# Altium project Sensor_PCI_V1.PrjPcb
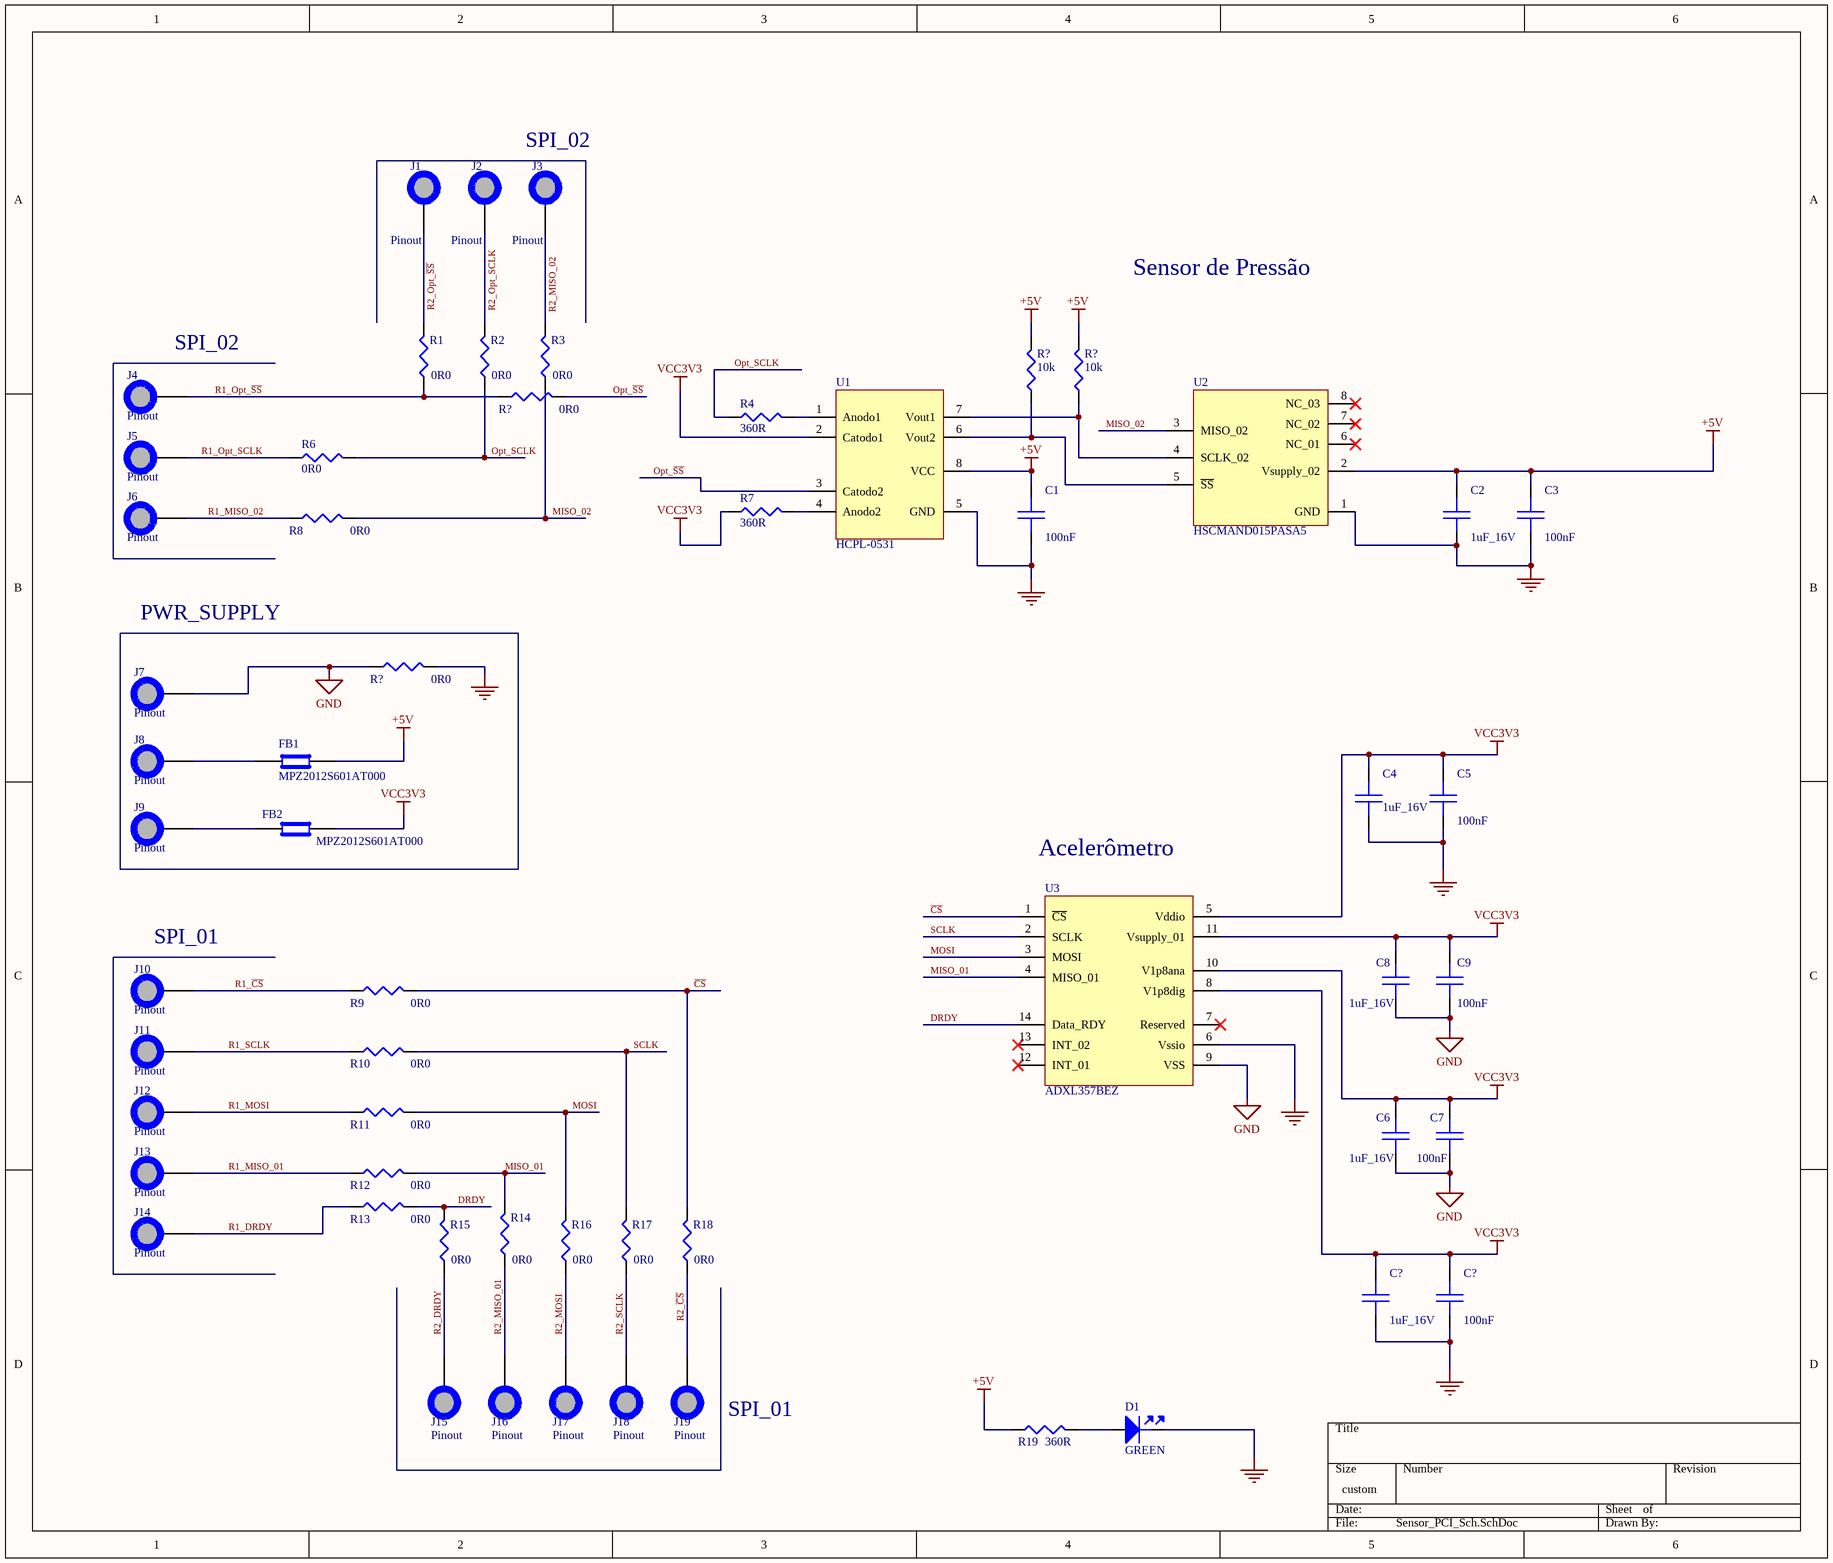
[diagram p0: Sensor_PCI_Sch.SchDoc]
1 sheet, 58 parts. Net scope: global (net labels, ports and power ports of the same name join across sheets).
Board file: Sensor_PCI_pcb.PcbDoc

## Sheet Sensor_PCI_Sch.SchDoc
size 342 x 292 mm; SheetNumber: 1; SheetTotal: 1

### Parts
(Parts that share a designator on the sheet are numbered #1, #2 ... from top to bottom, then left to right.)
C1  100nF  [CP_0805]
C2  1uF_16V  [C_1206]
C3  100nF  [CP_0805]
C4  1uF_16V  [C_1206]
C5  100nF  [CP_0805]
C6  1uF_16V  [C_1206]
C7  100nF  [CP_0805]
C8  1uF_16V  [C_1206]
C9  100nF  [CP_0805]
C?#1  1uF_16V  [C_1206]
C?#2  100nF  [CP_0805]
D1  GREEN  [LED_Green]
FB1  MPZ2012S601AT000  [CP_0805]
FB2  MPZ2012S601AT000  [CP_0805]
J1  Pinout  [Pinout]
J2  Pinout  [Pinout]
J3  Pinout  [Pinout]
J4  Pinout  [Pinout]
J5  Pinout  [Pinout]
J6  Pinout  [Pinout]
J7  Pinout  [Pinout]
J8  Pinout  [Pinout]
J9  Pinout  [Pinout]
J10  Pinout  [Pinout]
J11  Pinout  [Pinout]
J12  Pinout  [Pinout]
J13  Pinout  [Pinout]
J14  Pinout  [Pinout]
J15  Pinout  [Pinout]
J16  Pinout  [Pinout]
J17  Pinout  [Pinout]
J18  Pinout  [Pinout]
J19  Pinout  [Pinout]
R1  0R0  [R_0805]
R2  0R0  [R_0805]
R3  0R0  [R_0805]
R4  360R  [R_0805]
R6  0R0  [R_0805]
R7  360R  [R_0805]
R8  0R0  [R_0805]
R9  0R0  [R_0805]
R10  0R0  [R_0805]
R11  0R0  [R_0805]
R12  0R0  [R_0805]
R13  0R0  [R_0805]
R14  0R0  [R_0805]
R15  0R0  [R_0805]
R16  0R0  [R_0805]
R17  0R0  [R_0805]
R18  0R0  [R_0805]
R19  360R  [R_0805]
R?#1  10k  [R_0805]
R?#2  10k  [R_0805]
R?#3  0R0  [R_0805]
R?#4  0R0  [R_0805]
U1  HCPL-0531  [SMT_08_1.3mm]
U2  HSCMAND015PASA5  [SMT_08_2.54mm]
U3  ADXL357BEZ  [Quad_14_1.2mm]

### Blocks framed on the sheet
PWR_SUPPLY: FB1 FB2 J7-J9 R?#4

### Nets
+5V: C1.2 C2.1 C3.2 FB1.2 R19.1 R?#1.2 R?#2.2 U1.8(VCC) U2.2(Vsupply_02)
GND: C1.1 C2.2 C3.1 C4.2 C5.1 C6.2 C7.1 C8.2 C9.1 C?#1.2 C?#2.1 D1.1(KAT) J7.1 R?#4.1 R?#4.2 U1.5(GND) U2.1(GND) U3.6(Vssio) U3.9(VSS)
VCC3V3: C4.1 C5.2 C6.1 C7.2 C8.1 C9.2 C?#1.1 C?#2.2 FB2.2 R7.1 U1.2(Catodo1) U3.5(Vddio) U3.8(V1p8dig) U3.10(V1p8ana) U3.11(Vsupply_01)
~{CS}: R9.2 R18.2 U3.1(~{CS})
DRDY: R13.2 R15.2 U3.14(Data_RDY)
MISO_01: R12.2 R14.2 U3.4(MISO_01)
MISO_02: R3.1 R8.2 U2.3(MISO_02)
MOSI: R11.2 R16.2 U3.3(MOSI)
Opt_~{SS}: R?#3.2 U1.3(Catodo2)
Opt_SCLK: R2.1 R4.1 R6.2
R1_~{CS}: J10.1 R9.1
R1_DRDY: J14.1 R13.1
R1_MISO_01: J13.1 R12.1
R1_MISO_02: J6.1 R8.1
R1_MOSI: J12.1 R11.1
R1_Opt_~{SS}: J4.1 R1.1 R?#3.1
R1_Opt_SCLK: J5.1 R6.1
R1_SCLK: J11.1 R10.1
R2_~{CS}: J19.1 R18.1
R2_DRDY: J15.1 R15.1
R2_MISO_01: J16.1 R14.1
R2_MISO_02: J3.1 R3.2
R2_MOSI: J17.1 R16.1
R2_Opt_~{SS}: J1.1 R1.2
R2_Opt_SCLK: J2.1 R2.2
R2_SCLK: J18.1 R17.1
SCLK: R10.2 R17.2 U3.2(SCLK)
NetD1_2: D1.2(ANODE) R19.2
NetFB1_1: FB1.1 J8.1
NetFB2_1: FB2.1 J9.1
NetR4_2: R4.2 U1.1(Anodo1)
NetR7_2: R7.2 U1.4(Anodo2)
NetR?#1_1: R?#1.1 U1.6(Vout2) U2.5(~{SS})
NetR?#2_1: R?#2.1 U1.7(Vout1) U2.4(SCLK_02)

Not connected (* = marked no-connect by the designer): U2 6(NC_01)* 7(NC_02)* 8(NC_03)*; U3 7(Reserved)* 12(INT_01)* 13(INT_02)*

### Notes on the sheet
- SPI_02
- Sensor de Pressão
- (near J4) SPI_02
- Acelerômetro
- (near J10) SPI_01
- (near J19) SPI_01

### Library data of the parts
C1 C3 C5 C7 C9 C?#2 = C_0805_0.1uF: Cap Ceramic 0.1uF 50V X7R 20% Pad SMD 0805 150°C T/R; Manufacturer: Vishay Vitramon; Manufacturer Part Number: VJ0805Y104MXAMR; Supplier 1: Mouser; RoHS: Yes; Category: Ceramic Capacitors; Stock 1: 26836; Pricing 1: 1=0,33000, 10=0,23700, 50=0,23700, 100=0,14200, 1000=0,09000, 10000=0,07300 (USD); Mount: Surface Mount; Case/Package: 0805; Case Code (Imperial): 0805; Case Code (Metric): 2012; Min Operating Temperature: -55°C; Max Operating Temperature: 150°C; Capacitance: 100nF; Voltage Rating (DC): 50V; Tolerance: 20%; Packaging: Tape and Reel; Package Quantity: 10000; Dielectric: X7R; Termination: SMD/SMT; Series: VJ COMM; Construction: Flat; Length: 2mm; Width: 1.25mm; Height: 1.45mm; Depth: 1.25mm; RoHS Compliant: Yes; ComponentLink1URL: http://www.mouser.com/ds/2/427/vjcommercialseries-222796.pdf?src-supplier=Mouser; ComponentLink1Description: http://www.mouser.com/ds/2/427/vjcommercialseries-222796.pdf?src-supplier=Mouser; ComponentLink2URL: http://www.vishay.com/docs/45199/commseri.pdf?src-supplier=Avnet; ComponentLink2Description: http://www.vishay.com/docs/45199/commseri.pdf?src-supplier=Avnet; ComponentLink3URL: http://www.vishay.com/docs/45199/vjcommercialseries.pdf?src-supplier=Digi-Key; ComponentLink3Description: http://www.vishay.com/docs/45199/vjcommercialseries.pdf?src-supplier=Digi-Key; ComponentLink4URL: http://www.vishay.com/docs/45051/vjvitramonpackaging.pdf?src-supplier=Digi-Key; ComponentLink4Description: http://www.vishay.com/docs/45051/vjvitramonpackaging.pdf?src-supplier=Digi-Key; Supplier Part Number 1: 77-VJ0805Y104MXAMR
C2 C4 C6 C8 C?#1 = C_1206_1uF_16V: Cap Ceramic 1uF 16V Y5V 20% SMD 1206 85°C Plastic T/R; Manufacturer: Vishay Vitramon; Manufacturer Part Number: VJ1206V105MXJTW1BC; Dielectric Material: Tantalum; Supplier 1: Mouser; RoHS: Yes; Category: Ceramic Capacitors; Stock 1: 370; Pricing 1: 1=0,44000, 10=0,31000, 50=0,31000, 100=0,18600, 1000=0,11800, 10000=0,09500 (USD); Mount: Surface Mount; Case/Package: 1206; Case Code (Metric): 3216; Case Code (Imperial): 1206; Weight: 0.000571oz; Min Operating Temperature: -25°C; Max Operating Temperature: 85°C; Capacitance: 1uF; Tolerance: 20%; Packaging: Tape and Reel; Package Quantity: 3000; Voltage Rating (DC): 16V; Dielectric: Y5V; Termination: SMD/SMT; Series: VJ W1BC; Construction: Flat; Length: 3.2mm; Width: 1.6mm; Height: 1.9mm; Depth: 1.6mm; Lead Free: Lead Free; ComponentLink1URL: https://datasheet.ciiva.com/5418/vjw1bcbascomseries-223529-5418534.pdf?src-supplier=Mouser; ComponentLink1Description: https://datasheet.ciiva.com/5418/vjw1bcbascomseries-223529-5418534.pdf?src-supplier=Mouser; Supplier Part Number 1: 77-VJ1206V105MXJTBC
D1 = Led Green_1: LED Single Chip Green 570nm 20mA 2-Pin 0603 T/R; Manufacturer: Osram Opto; Manufacturer Part Number: LGL29K-G2J1-24-Z; Lens Color: White; Forward Voltage: 2.2V; Luminous Intensity: 5.6mcd; Viewing Angle: 160°; Lens Style: Flat,Diffused,Colorless,Rectangular; Test Current: 2mA; Luminous Flux: 0.012lm; Number of LEDs: 1; Lens Transparency: Diffused; Reverse Voltage: 12V; Lens Size: 0.8mm; Supplier 1: Arrow Electronics; RoHS: Yes; Category: LEDs; Mount: Surface Mount; Case/Package: 0603; Number of Pins: 2; Color: Green; Case Code (Metric): 1608; Case Code (Imperial): 0603; Min Operating Temperature: -40°C; Max Operating Temperature: 100°C; Illumination Color: Green; Forward Current: 20mA; Packaging: Tape and Reel; Package Quantity: 5000; Dominant Wavelength: 570nm; Number of Elements: 1; Series: SmartLED; Length: 1.3mm; Width: 0.8mm; Height: 0.65mm; Depth: 0.8mm; Radiation Hardening: No; RoHS Compliant: Yes; ComponentLink1URL: https://datasheet.ciiva.com/4689/g-l29k-39844-4689584.pdf?src-supplier=Mouser; ComponentLink1Description: https://datasheet.ciiva.com/4689/g-l29k-39844-4689584.pdf?src-supplier=Mouser; ComponentLink2URL: https://datasheet.ciiva.com/15198/getdatasheetpartid-571127-15198411.pdf?src-supplier=Verical; ComponentLink2Description: https://datasheet.ciiva.com/15198/getdatasheetpartid-571127-15198411.pdf?src-supplier=Verical; ComponentLink3URL: https://datasheet.ciiva.com/2112/00077107-0-2112887.pdf?src-supplier=Digi-Key; ComponentLink3Description: https://datasheet.ciiva.com/2112/00077107-0-2112887.pdf?src-supplier=Digi-Key; ComponentLink4URL: https://datasheet.ciiva.com/2112/00077107-0-2112886.pdf?src-supplier=Digi-Key; ComponentLink4Description: https://datasheet.ciiva.com/2112/00077107-0-2112886.pdf?src-supplier=Digi-Key; ComponentLink5URL: https://datasheet.ciiva.com/2112/00077107-0-2112888.pdf?src-supplier=Digi-Key; ComponentLink5Description: https://datasheet.ciiva.com/2112/00077107-0-2112888.pdf?src-supplier=Digi-Key; Supplier Part Number 1: LG L29K-G2J1-24-Z
FB1 FB2 = MPZ2012S601AT000: 0805 600Ω ±25% DCR=0.1Ω 2A; Manufacturer: TDK; Impedance: 600R; DC Resistance (DCR): 100mR; Number of Lines: 1; Supplier 1: Mouser; Manufacturer Part Number: MPZ2012S601AT000; RoHS: Yes; Category: Ferrite Beads and Chips; Stock 1: 15; Pricing 1: 1=0,13000, 10=0,08200, 50=0,08200, 100=0,05000, 1000=0,03700, 10000=0,03600 (USD); Mount: Surface Mount; Case/Package: 0805; Case Code (Metric): 2012; Case Code (Imperial): 0805; Min Operating Temperature: -55°C; Max Operating Temperature: 125°C; Packaging: Tape and Reel; Package Quantity: 1; Current Rating: 2A; Max DC Current: 2A; Series: MPZ; Max Current Rating: 2A; Length: 0.079inch; Width: 0.049inch; Height: 0.041inch; Reach SVHC Compliant: Yes; Lead Free: Lead Free; RoHS Compliant: Yes; ComponentLink1URL: https://datasheet.ciiva.com/46634/beads-commercial-power-mpz-en-46634335.pdf?src-supplier=Digi-Key; ComponentLink1Description: https://datasheet.ciiva.com/46634/beads-commercial-power-mpz-en-46634335.pdf?src-supplier=Digi-Key; ComponentLink2URL: https://datasheet.ciiva.com/46634/beads-commercial-power-mpz-en-46634377.pdf?src-supplier=Digi-Key; ComponentLink2Description: https://datasheet.ciiva.com/46634/beads-commercial-power-mpz-en-46634377.pdf?src-supplier=Digi-Key; ComponentLink3URL: https://datasheet.ciiva.com/46634/beads-commercial-power-mpz-en-46634606.pdf?src-supplier=Digi-Key; ComponentLink3Description: https://datasheet.ciiva.com/46634/beads-commercial-power-mpz-en-46634606.pdf?src-supplier=Digi-Key; Supplier Part Number 1: 810-MPZ2012S601AT000
R1-R3 R6 R8-R18 R?#3 R?#4 = Res_0805_0R0: CRCW Thick Film Commodity Chip Resistor Jumper 0805 Size 0 Ohm 0.125 W 2-Pin SMD Paper T/R; Manufacturer: Vishay Dale; Manufacturer Part Number: CRCW08050000Z0ECC; Resistance: 0mR; Max Power Dissipation: 125mW; Supplier 1: Mouser; RoHS: Yes; Category: Chip SMD Resistors; Stock 1: 327854; Pricing 1: 1=0,10000, 10=0,04200, 50=0,04200, 100=0,01700, 1000=0,00800, 10000=0,00500 (USD); Case/Package: 0805; Case Code (Imperial): 0805; Case Code (Metric): 2012; Min Operating Temperature: -55°C; Max Operating Temperature: 155°C; Resistor Type: Thick Film; Packaging: Tape and Reel; Number of Terminations: 2; RoHS Compliant: Yes; ComponentLink1URL: http://www.vishay.com/docs/28773/crcwce3.pdf?src-supplier=Digi-Key; ComponentLink1Description: http://www.vishay.com/docs/28773/crcwce3.pdf?src-supplier=Digi-Key; Supplier Part Number 1: 71-CRCW08050000Z0ECC
R4 R7 R19 = Res_0805_360R: Res Thick Film 0805 360 Ohm 5% 1/8W ±200ppm/°C Molded SMD SMD Paper T/R; Manufacturer: Vishay Dale; Manufacturer Part Number: CRCW0805360RJNEA; Power Rating: 125mW; Voltage Rating: 150V; Supplier 1: Mouser; RoHS: Yes; Category: Chip SMD Resistors; Stock 1: 4310; Pricing 1: 1=0,10000, 10=0,05000, 50=0,05000, 100=0,02100, 1000=0,01000, 10000=0,00600 (USD); Case/Package: 0805; Number of Pins: 2; Weight: 0.000194oz; Case Code (Imperial): 0805; Case Code (Metric): 2012; Contact Plating: Tin; Min Operating Temperature: -55°C; Max Operating Temperature: 155°C; Resistance: 360R; Tolerance: 5%; Packaging: Cut Tape; Package Quantity: 1; Termination: SMD/SMT; Resistor Type: Thick Film; Number of Terminations: 2; Temperature Coefficient: 200ppm/°C; Max Power Dissipation: 125mW; Voltage Rating (DC): 150V; Features: Automotive AEC-Q200; Series: CRCW; Length: 0.079inch; Width: 0.049inch; Height: 0.02inch; Depth: 1.25mm; Height - Seated (Max): 0.02inch; Ratings: AEC-Q200; Radiation Hardening: No; RoHS Compliant: Yes; Military Standard: Not; Lead Free: Lead Free; ComponentLink1URL: https://datasheet.ciiva.com/2464/dcrcwe3-2464844.pdf?src-supplier=Digi-Key; ComponentLink1Description: https://datasheet.ciiva.com/2464/dcrcwe3-2464844.pdf?src-supplier=Digi-Key; ComponentLink2URL: https://datasheet.ciiva.com/2464/dcrcwe3-2464845.pdf?src-supplier=Digi-Key; ComponentLink2Description: https://datasheet.ciiva.com/2464/dcrcwe3-2464845.pdf?src-supplier=Digi-Key; ComponentLink3URL: https://datasheet.ciiva.com/2464/dcrcwe3-2464843.pdf?src-supplier=Digi-Key; ComponentLink3Description: https://datasheet.ciiva.com/2464/dcrcwe3-2464843.pdf?src-supplier=Digi-Key; ComponentLink4URL: https://datasheet.ciiva.com/5552/dcrcwe3-109170-5552246.pdf?src-supplier=Mouser; ComponentLink4Description: https://datasheet.ciiva.com/5552/dcrcwe3-109170-5552246.pdf?src-supplier=Mouser; ComponentLink5URL: https://datasheet.ciiva.com/8942/dcrcwe3-8942602.pdf?src-supplier=Avnet; ComponentLink5Description: https://datasheet.ciiva.com/8942/dcrcwe3-8942602.pdf?src-supplier=Avnet; ComponentLink6URL: https://datasheet.ciiva.com/16334/dcrcwe3-16334181.pdf?src-supplier=Future+Electronics; ComponentLink6Description: https://datasheet.ciiva.com/16334/dcrcwe3-16334181.pdf?src-supplier=Future+Electronics; Supplier Part Number 1: 71-CRCW0805360RJNEA
R?#1 R?#2 = Res_0805_360R: Res Thick Film 0805 360 Ohm 5% 1/8W ±200ppm/°C Molded SMD SMD Paper T/R; Manufacturer: Vishay Dale; Manufacturer Part Number: CRCW0805360RJNEA; Resistance: 360R; Power Rating: 125mW; Voltage Rating: 150V; Supplier 1: Mouser; RoHS: Yes; Category: Chip SMD Resistors; Stock 1: 4310; Pricing 1: 1=0,10000, 10=0,05000, 50=0,05000, 100=0,02100, 1000=0,01000, 10000=0,00600 (USD); Case/Package: 0805; Number of Pins: 2; Weight: 0.000194oz; Case Code (Imperial): 0805; Case Code (Metric): 2012; Contact Plating: Tin; Min Operating Temperature: -55°C; Max Operating Temperature: 155°C; Tolerance: 5%; Packaging: Cut Tape; Package Quantity: 1; Termination: SMD/SMT; Resistor Type: Thick Film; Number of Terminations: 2; Temperature Coefficient: 200ppm/°C; Max Power Dissipation: 125mW; Voltage Rating (DC): 150V; Features: Automotive AEC-Q200; Series: CRCW; Length: 0.079inch; Width: 0.049inch; Height: 0.02inch; Depth: 1.25mm; Height - Seated (Max): 0.02inch; Ratings: AEC-Q200; Radiation Hardening: No; RoHS Compliant: Yes; Military Standard: Not; Lead Free: Lead Free; ComponentLink1URL: https://datasheet.ciiva.com/2464/dcrcwe3-2464844.pdf?src-supplier=Digi-Key; ComponentLink1Description: https://datasheet.ciiva.com/2464/dcrcwe3-2464844.pdf?src-supplier=Digi-Key; ComponentLink2URL: https://datasheet.ciiva.com/2464/dcrcwe3-2464845.pdf?src-supplier=Digi-Key; ComponentLink2Description: https://datasheet.ciiva.com/2464/dcrcwe3-2464845.pdf?src-supplier=Digi-Key; ComponentLink3URL: https://datasheet.ciiva.com/2464/dcrcwe3-2464843.pdf?src-supplier=Digi-Key; ComponentLink3Description: https://datasheet.ciiva.com/2464/dcrcwe3-2464843.pdf?src-supplier=Digi-Key; ComponentLink4URL: https://datasheet.ciiva.com/5552/dcrcwe3-109170-5552246.pdf?src-supplier=Mouser; ComponentLink4Description: https://datasheet.ciiva.com/5552/dcrcwe3-109170-5552246.pdf?src-supplier=Mouser; ComponentLink5URL: https://datasheet.ciiva.com/8942/dcrcwe3-8942602.pdf?src-supplier=Avnet; ComponentLink5Description: https://datasheet.ciiva.com/8942/dcrcwe3-8942602.pdf?src-supplier=Avnet; ComponentLink6URL: https://datasheet.ciiva.com/16334/dcrcwe3-16334181.pdf?src-supplier=Future+Electronics; ComponentLink6Description: https://datasheet.ciiva.com/16334/dcrcwe3-16334181.pdf?src-supplier=Future+Electronics; Supplier Part Number 1: 71-CRCW0805360RJNEA
U1 = Optoacoplador: Optocoupler DC-IN 2-CH Transistor With Base DC-OUT 8-Pin SOIC Tube; Manufacturer: Broadcom Avago; Manufacturer Part Number: HCPL-0531-000E; Number of Channels: 2; Isolation Voltage: 3.75kV; Max Power Dissipation: 45mW; Forward Current: 25mA; Reverse Breakdown Voltage: 5V; Forward Voltage: 1.7V; Output Current per Channel: 8mA; Max Output Voltage: 20V; Current Transfer Ratio: 50%; Input Current: 16mA; Input Type: DC; Power Supply: 30V; Approvals: UL; Supplier 1: Mouser; RoHS: Yes; Category: Optocouplers; Stock 1: 19; Pricing 1: 1=4,30000, 10=2,98000, 50=2,98000, 100=2,44000, 1000=1,81000, 10000=1,81000 (USD); Mount: Surface Mount; Case/Package: SOIC; Number of Pins: 8; Contact Plating: Tin,Matte; Min Operating Temperature: -55°C; Max Operating Temperature: 100°C; Packaging: Rail/Tube; Package Quantity: 100; Max Collector Current: 8mA; Max Input Current: 25mA; Number of Elements: 2; Power Dissipation: 45mW; Series: -; Max Output Current: 8mA; Isolation Voltage-Max: 3.75kV; Collector Emitter Breakdown Voltage: 20V; Radiation Hardening: No; Lead Free: Lead Free; Reach SVHC Compliant: Yes; RoHS Compliant: Yes; ComponentLink1URL: https://datasheet.ciiva.com/15118/getdatasheetpartid-117572-15118687.pdf?src-supplier=Verical; ComponentLink1Description: https://datasheet.ciiva.com/15118/getdatasheetpartid-117572-15118687.pdf?src-supplier=Verical; ComponentLink2URL: https://datasheet.ciiva.com/11772/0900766b807796f3-11772029.pdf?src-supplier=RSComponents; ComponentLink2Description: https://datasheet.ciiva.com/11772/0900766b807796f3-11772029.pdf?src-supplier=RSComponents; ComponentLink3URL: https://datasheet.ciiva.com/8065/1266282-8065578.pdf?src-supplier=Element14; ComponentLink3Description: https://datasheet.ciiva.com/8065/1266282-8065578.pdf?src-supplier=Element14; Supplier Part Number 1: 630-HCPL-0531-000E
U2 = Sensor_Pressão: Board Mount Pressure Sensors SMT, Single Ax Barbed Absolute, 5V; Manufacturer: Honeywell Sensing & Control; Nominal Supply Current: 2mA; Max Supply Voltage: 5.25V; Min Supply Voltage: 4.75V; Operating Pressure: 15PSI; Max Pressure: 30PSI; Accuracy: 0.25%; Max Supply Current: 3mA; Response Time: 1ms; Output Type: SPI,Digital; Supplier 1: Mouser; Manufacturer Part Number: HSCMAND015PASA5; RoHS: Yes; Category: Pressure Sensors; Stock 1: 87; Pricing 1: 1=71,24000, 10=67,05000, 50=60,77000, 100=57,41000, 1000=57,41000, 10000=57,41000 (USD); Mount: Surface Mount; Case/Package: SMD/SMT; Number of Pins: 8; Min Operating Temperature: -20°C; Max Operating Temperature: 85°C; Package Quantity: 1; Operating Supply Voltage: 5V; Termination: Gull Wing; Port Style: Barbed; Voltage Rating (DC): 5V; Pressure Type: Absolute; Series: TruStability® HSC; Supply Current: 2mA; RoHS Compliant: Yes; ComponentLink1URL: https://datasheet.ciiva.com/2826/honeywell-sensing-board-mount-pressure-sensors-line-guide-008152-16-en-2826384.pdf?src-supplier=Digi-Key; ComponentLink1Description: https://datasheet.ciiva.com/2826/honeywell-sensing-board-mount-pressure-sensors-line-guide-008152-16-en-2826384.pdf?src-supplier=Digi-Key; ComponentLink2URL: https://datasheet.ciiva.com/1319/1676934-1319217.pdf?src-supplier=Element14; ComponentLink2Description: https://datasheet.ciiva.com/1319/1676934-1319217.pdf?src-supplier=Element14; Supplier Part Number 1: 785-HSCMAND015PASA5
U3 = Acelerômetro: Accelerometer Tri-axis Digital Accel; Manufacturer: Analog Devices; Output Type: SPI,I2C; Axis: X, Y, Z; Bandwidth: 1Hz; Supplier 1: Mouser; Manufacturer Part Number: ADXL357BEZ; RoHS: Yes; Category: Accelerometers; Stock 1: 9624; Pricing 1: 1=73,06000, 10=66,41000, 50=66,41000, 100=66,41000, 1000=66,41000, 10000=66,41000 (USD); Mount: Surface Mount; Case/Package: CLCC; Number of Pins: 14; Min Operating Temperature: -40°C; Max Operating Temperature: 125°C; Packaging: Tray; RoHS Compliant: Yes; ComponentLink1URL: http://www.farnell.com/datasheets/2261940.pdf?src-supplier=Farnell; ComponentLink1Description: http://www.farnell.com/datasheets/2261940.pdf?src-supplier=Farnell; ComponentLink2URL: https://www.analog.com/media/en/technical-documentation/data-sheets/ADXL356-357.pdf?src-supplier=Digi-Key; ComponentLink2Description: https://www.analog.com/media/en/technical-documentation/data-sheets/ADXL356-357.pdf?src-supplier=Digi-Key; Supplier Part Number 1: 584-ADXL357BEZ

## Assembly variants
R1_NF: not fitted R5 R6 R8 R9 R10 R11 R12 R13
R2_NF: not fitted R1 R2 R3 R14 R15 R16 R17 R18